# Altium schematic sheet WheatstonePrimaryAmplifier.SchDoc
size A3
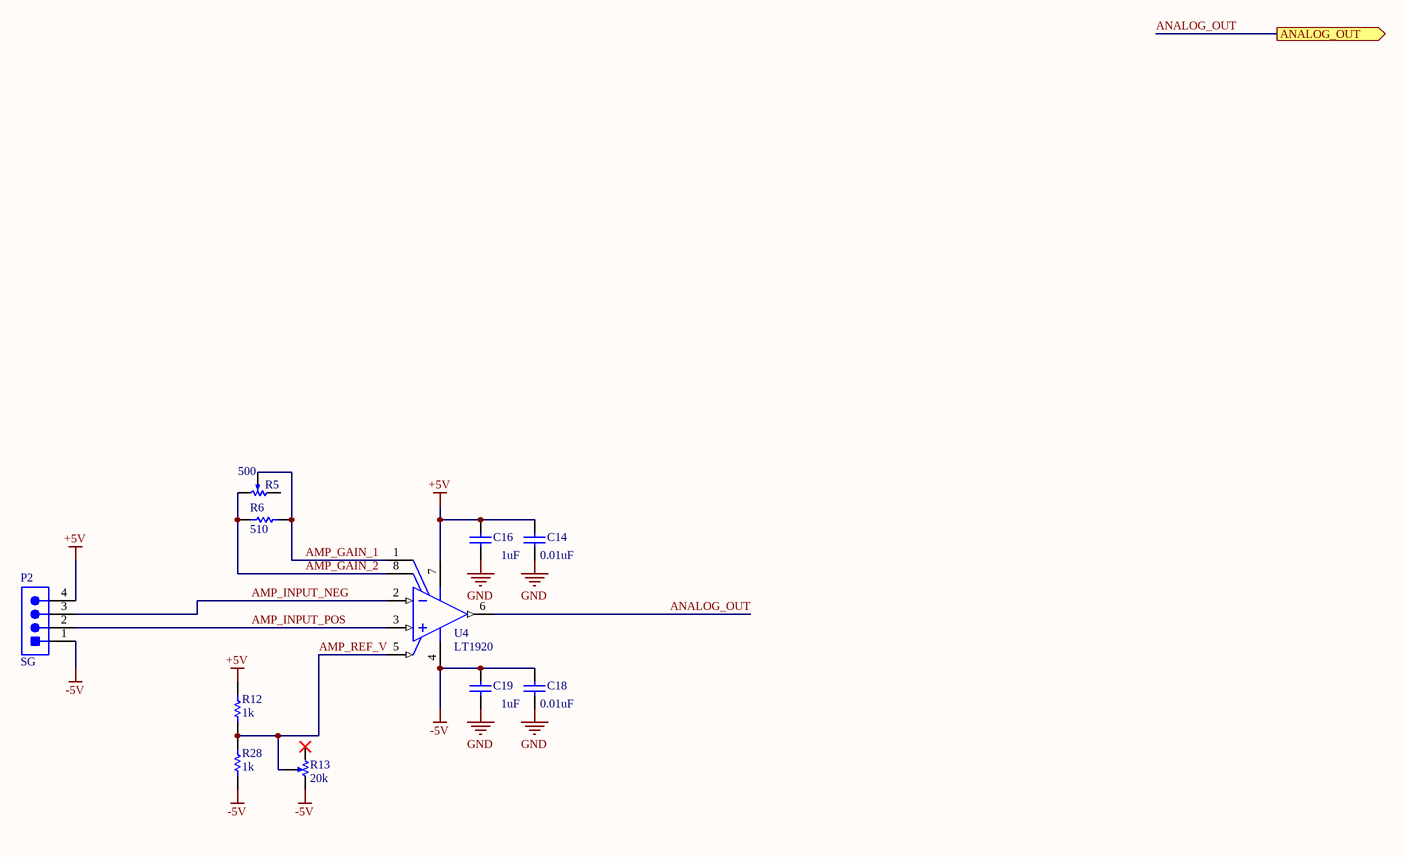
[diagram p0: WheatstonePrimaryAmplifier.SchDoc]

## Parts
C14  value 0.01uF  [1608[0603]]  (hidden comment: Cap Semi)
C16  value 1uF  [1608[0603]]  (hidden comment: Cap Semi)
C18  value 0.01uF  [1608[0603]]  (hidden comment: Cap Semi)
C19  value 1uF  [1608[0603]]  (hidden comment: Cap Semi)
P2  SG  [TECO-5-103414-2_V]
R5  500  [Trimpot_Cut_tape_3.4x3.4x2]
R6  510  [RESC0603(1608)_L]
R12  1k  [RESC1608X55X25ML10T15]
R13  20k  [Trimpot_Cut_tape_3.4x3.4x2]
R28  1k  [RESC1608X55X25ML10T15]
U4  LT1920  [LT-S8-8_L]

## Ports
ANALOG_OUT (out)

## Nets
+5V: C14.1 C16.1 P2.4 R12.2 U4.7(+VS)
-5V: C18.1 C19.1 P2.1 R13.3 R28.1 U4.4(-VS)
GND: C14.2 C16.2 C18.2 C19.2
AMP_GAIN_1: R5.2 R6.2 U4.1(RG)
AMP_GAIN_2: R5.3 R6.1 U4.8(RG)
AMP_INPUT_NEG: P2.3 U4.2(-IN)
AMP_INPUT_POS: P2.2 U4.3(+IN)
AMP_REF_V: R12.1 R13.2 R28.2 U4.5(REF)
ANALOG_OUT: U4.6(OUTPUT) ; port ANALOG_OUT

Not connected (* = marked no-connect by the designer): R5 1; R13 1*

## Notes on the sheet
- Title
- Size:
- Date:
- A3
- Number:
- Time:
- Revision:
- Sheet
- of
- File:

## Library data of the parts
C14 C16 C18 C19 = Cap Semi: Capacitor (Semiconductor SIM Model); Published: 8-Jun-2000; LatestRevisionDate: 29-May-2009; LatestRevisionNote: IPC-7351 Footprint Added.; PackageReference: C1206; Publisher: Altium Limited; PackageDescription: Chip Capacitor; Supplier 1: Digi-Key; Supplier Part Number 1: 490-10901-1-ND
P2 = CMP-2000-05625-1: Male Header, Pitch 2.54 mm, 1 x 4 Position, Height 14.199 mm, Tail Length 3.302 mm, -55 to 105 degC, RoHS, Rail/Tube; Manufacturer: TE Connectivity; 3D Model: 5-103414-2.pdf; Connector Type: Header,Shrouded; Mating Products: A34951-ND / -CONNRECEPTACLE4POS.10015AU / 103979-3-ND / -CONNRCPT4POS.100GOLD / 103978-3-ND / -CONNRCPT4POS.100GOLD / A34180-ND / -CONNRECEPTACLE4POS.100TIN / A34179-ND / -CONNRECEPTACLE4POS.10030AU / 104439-3-ND / -CONNRCPT4POS.10022-2630AU / 487769-2-ND / -SKTCONNW/DETENT4POSFLATFLX / A28358-ND / -CONNRECEPTACLE4POS.10015AU / A28357-ND / -CONNRECEPTACLE4POS.10030AU / A28360-ND / -CONNRECEPTACLE4POS.1"UNLOAD / More...; Dynamic Catalog: AMPMODUModIISeries; Pitch: 0.100"(2.54mm); Other Names: A32979; Featured Product: AMPMODUConnectors; Catalog Drawings: ShroudedSquareStraight / ShroudedStraightSide; Number of Positions: 4; Number of Positions Loaded: All; Contact Mating Length: 0.240"(6.10mm); Color: Black; Mounting Type: ThroughHole; Contact Finish: Gold; Package Description: Male Header, Pitch 2.54 mm, 1 x 4 Position, Height 14.199 mm, Tail Length 3.302 mm; Series: AMPMODUModII; Family: RectangularConnectors-Headers,MalePins; Packaging: Tube; Contact Type: MalePin; Standard Package: 40; Mounting Technology: ThroughHole; Datasheet Version: Rev. P2, 03/2011; RoHS Information: 5-103414-2StatementofCompliance; Package Reference: 5-103414-2; Number of Rows: 1; Datasheet URL: http://www.te.com/commerce/DocumentDelivery/DDEController?Action=srchrtrv&DocNm=103414&DocType=Customer+Drawing&DocLang=English&DocFormat=pdf&PartCntxt=5-103414-2; Contact Finish Thickness: 30µin(0.76µm); Termination: Solder; Manufacturer URL: http://www.te.com/; Category: Connectors,Interconnects
R5 R13 = Component_1
R6 = CMP-1012-00067-1: 510R 0.1W 5% 0603 (1608 Metric)  SMD; Case-EIA: 0603; Value: 510.00 Ohm; Case-Metric: 1608; Technology: SMT; Power: 0.1 W; Tolerance: 5 %
R12 R28 = CMP-1659-00009-3: Chip Resistor, 1 KOhm, +/-1%, 0.1 W, -55 to 155 degC, 0603 (1608 Metric), RoHS, Tape and Reel; Voltage Rating: 50 V; PackageReference: 0603; Packaging: Tape and Reel; DatasheetVersion: Rev. 4, 02/2016; REACH SVHC: No SVHC; Height: 0.45 mm; Pins: 2; Length: 1.6 mm; Max Operating Temperature: 155 degC; Mounting Technology: Surface Mount; Mount: Surface Mount; Package Quantity: 200; Min Operating Temperature: -55 degC; RoHSCompliant: true; PackageDescription: 2-Pin Surface Mount Device, Body 1.6 x 0.8 mm
U4 = CMP-0359-03370-2: Single Channel, Resistor Gain Programmable, Precision Instrumentation Operational Amplifier, 0.8 MHz Typical GBW, 1.2 V/us Typical SR, 4.6 to 40 V, 8-Pin SOIC (S8-8), Commercial, Pb-Free; Manufacturer: Linear Technology; PartNumber: LT1920CS8#PBF; GBW (MHz) Typical: 0.8; Vs Min (V): 4.6; Vs Max (V): 40; SR (V/us) Typical: 1.2; Channels (#): 1; Vos (mV) Typical: 0.03; Is (mA) Typical: 0.9; Vos (mV) Guaranteed: 0.125; ComponentLink1Description: Manufacturer URL; ComponentLink3URL: http://cds.linear.com/docs/en/packaging/05081610_G_SO8.pdf; ComponentLink1URL: http://www.linear.com/; ComponentLink3Description: Package Specification; PackageReference: LT-S8-8; Mounting Technology: Surface Mount; PackageVersion: Rev G; RevisionNote: URLs updated; PackageDescription: 8-Pin Plastic Small Outline, Body 4.9 x 3.9 mm, Pitch 1.27 mm; RoHS: Pb-Free; ComponentLink2Description: Datasheet; ComponentLink2URL: http://cds.linear.com/docs/en/datasheet/1920f.pdf; Linear Technology Part Number: LT1920; Type: IA